# Altium schematic sheet Powerswitch.SchDoc
size A4
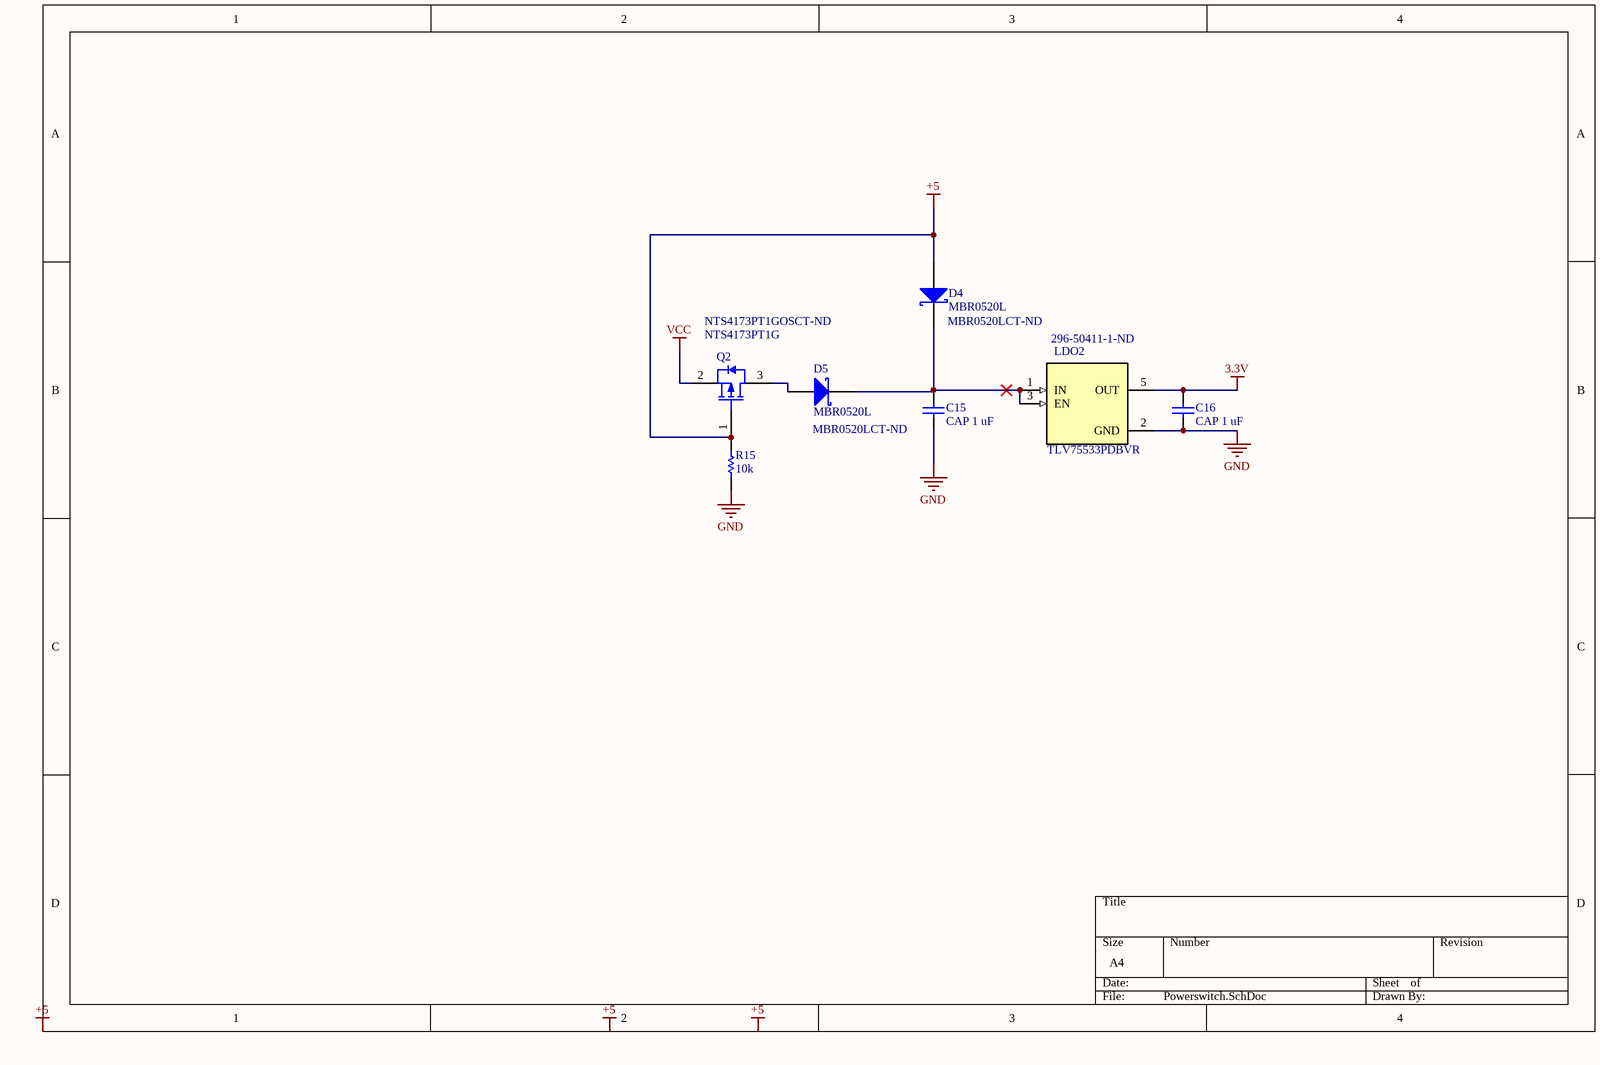
[diagram p0: Powerswitch.SchDoc]

## Parts
C15  CAP 1 uF  [CL10A105KB8NNNC]
C16  CAP 1 uF  [CL10A105KB8NNNC]
D4  MBR0520L  Supplier Part Number 1: MBR0520LCT-ND  [ON_Semi_CASE_425_0]
D5  MBR0520L  Supplier Part Number 1: MBR0520LCT-ND  [ON_Semi_CASE_425_0]
LDO2  TLV75533PDBVR  Supplier Part Number 1: 296-50411-1-ND  [SOT95P280X145-5N]
Q2  NTS4173PT1G  Supplier Part Number 1: NTS4173PT1GOSCT-ND  [ONSC-SC-70-3-419-04_V]
R15  10k  [RK73H1JTTD1002F]

## Nets
3.3V: C16.1 LDO2.5(OUT)
+5: D4.1(A) Q2.1(G) R15.2
GND: C15.2 C16.2 LDO2.2(GND) R15.1
VCC: Q2.2(S)
NetC15_1: C15.1 D4.2(K) D5.2(K) LDO2.1(IN) LDO2.3(EN)
NetD5_1: D5.1(A) Q2.3(D)

## Notes on the sheet
- Labels drawn without touching a wire or pin: +5

## Library data of the parts
C15 C16 = Cap: Capacitor; Published: 8-Jun-2000; LatestRevisionDate: 17-Jul-2002; LatestRevisionNote: Re-released for DXP Platform.; Publisher: Altium Limited
D4 D5 = MBR0520L: Schottky Diode; Manufacturer: ON Semiconductor / Fairchild; Average Rectified Current: 500mA; Max Reverse Voltage (DC): 20V; Element Configuration: Single; Forward Voltage: 385mV; Max Surge Current: 5.5A; Peak Reverse Current: 250uA; Polarity: Standard; Power Dissipation: 400mW; Capacitance: 4pF; Current Rating: 500A; Manufacturer Part Number: MBR0520L; RoHS: Yes; Mount: Surface Mount; Number of Pins: 2; Weight: 0.03g; Min Operating Temperature: -65°C; Max Operating Temperature: 125°C; Packaging: Tape and Reel; Package Quantity: 3000; Max Forward Surge Current (Ifsm): 5.5A; Forward Current: 500mA; Max Repetitive Reverse Voltage (Vrrm): 20V; Peak Non-Repetitive Surge Current: 5.5A; Max Reverse Leakage Current: 250uA; Voltage Rating (DC): 20V; Output Current: 500mA; Length: 2.7mm; Height: 1.03mm; Width: 1.6mm; Radiation Hardening: No; Lead Free: Lead Free; REACH SVHC: No SVHC; ComponentLink1URL: http://www.farnell.com/datasheets/2304093.pdf?src-supplier=Farnell; ComponentLink1Description: http://www.farnell.com/datasheets/2304093.pdf?src-supplier=Farnell; ComponentLink2URL: http://www.mouser.com/ds/2/149/MBR0520L-67539.pdf?src-supplier=Mouser; ComponentLink2Description: http://www.mouser.com/ds/2/149/MBR0520L-67539.pdf?src-supplier=Mouser; ComponentLink3URL: https://www.fairchildsemi.com/datasheets/MB/MBR0520L.pdf?src-supplier=Digi-Key; ComponentLink3Description: https://www.fairchildsemi.com/datasheets/MB/MBR0520L.pdf?src-supplier=Digi-Key; ComponentLink4URL: https://www.fairchildsemi.com/datasheets/MB/MBR0520L.pdf?src-supplier=Avnet; ComponentLink4Description: https://www.fairchildsemi.com/datasheets/MB/MBR0520L.pdf?src-supplier=Avnet; ComponentLink5URL: http://www.fairchildsemi.com/ds/MB/MBR0520L.pdf?src-supplier=Avnet+Europe; ComponentLink5Description: http://www.fairchildsemi.com/ds/MB/MBR0520L.pdf?src-supplier=Avnet+Europe; ComponentLink6URL: http://www.jameco.com/Jameco/Products/ProdDS/871594.pdf?src-supplier=Jameco; ComponentLink6Description: http://www.jameco.com/Jameco/Products/ProdDS/871594.pdf?src-supplier=Jameco; ComponentLink7URL: http://www.fairchildsemi.com/ds/MB/MBR0520L.pdf?src-supplier=Future+Electronics; ComponentLink7Description: http://www.fairchildsemi.com/ds/MB/MBR0520L.pdf?src-supplier=Future+Electronics; ComponentLink8URL: http://www.farnell.com/datasheets/48015.pdf?src-supplier=Element14; ComponentLink8Description: http://www.farnell.com/datasheets/48015.pdf?src-supplier=Element14; Supplier 1: Digi-Key
LDO2 = TLV75533PDBVR: 500mA Low-IQ Small-Size Low-Dropout _LDO_ Regulator 5-SOT-23 -40 to 125; MF: Texas Instruments; Package: SOT-23 Texas Instruments; MP: TLV75533PDBVR; SnapEDA_Link: https://www.snapeda.com/parts/TLV75533PDBVR/Texas%20Instruments/view-part/?ref=snap; Availability: Unavailable; Price: None; Value: *; Supplier 1: Digi-Key
Q2 = CMP-1058-00621-1: Power MOSFET, -30 V, -1.3 A, Single P-Channel, 3-Pin SC-70, Pb-Free, Tape and Reel; Manufacturer: On Semiconductor; Coss Typ (pF): 55; VGS(th) Max (V): 1.5; Channel Polarity: P Channel; Crss Typ (pF): 40; Qrr Typ (nC): 7; VGS Max (V): 12; Ciss Typ (pF): 430; V(BR)DSS Min (V): 30; RoHS: Pb-Free; PartNumber: NTS4173PT1G; Mounting Technology: Surface Mount; DatasheetVersion: Rev. 0; ComponentLink2Description: Datasheet; Packing: Tape and Reel; ComponentLink3URL: http://www.onsemi.cn/pub_link/Collateral/419-04.PDF; ComponentLink1Description: Manufacturer URL; Package Type: SC-70-3 / SOT-323-3; ComponentLink1URL: http://www.onsemi.com/; ComponentLink2URL: http://www.onsemi.cn/pub_link/Collateral/NTS4173P-D.PDF; PackageDescription: 3-Pin Small Outline Transistor, Body 2 x 1.25 mm, Pitch 0.65 mm; ComponentLink3Description: Package Specification; PackageReference: SC-70-3-419-04; Configuration: Single; PackageVersion: Rev. N, 11/2008; Supplier 1: Digi-Key
R15 = Res1: Resistor; Published: 8-Jun-2000; LatestRevisionDate: 17-Jul-2002; LatestRevisionNote: Re-released for DXP Platform.; PackageReference: AXIAL-0.3; Publisher: Altium Limited; PackageDescription: Axial Device, Thru-Hole; 2 Leads; 0.3 in Pin Spacing; Value: 10k